# Altium schematic sheet 1_MCU.schdoc
size 429 x 307 mm; Symbol: Sheet-Symbol_A4; Device: Sheet-Symbol_A4; @Project Name: Stratus-Hackpad; @Page Count: 2; @Update Date: 2026-03-22; @Create Date: 2026-03-22; @Schematic Name: Stratus Hackpad; @Page No: 1; @Page Name: MCU; Company: Dhruvin Sarkar; Reviewed: EasyEDA; Version: V1.0; Page Size: A3; Part Number: JLCPCB-002; Drawn: Dhruvin Sarkar; @Board Name: Stratus Hackpad; @Create Time: 22:37:34; @Update Time: 22:43:27; Width: 1655; Height: 1170; Region Start: 1; X Region Count: 6; Y Region Count: 4; Blade Width: 10; Title Block Position: 3
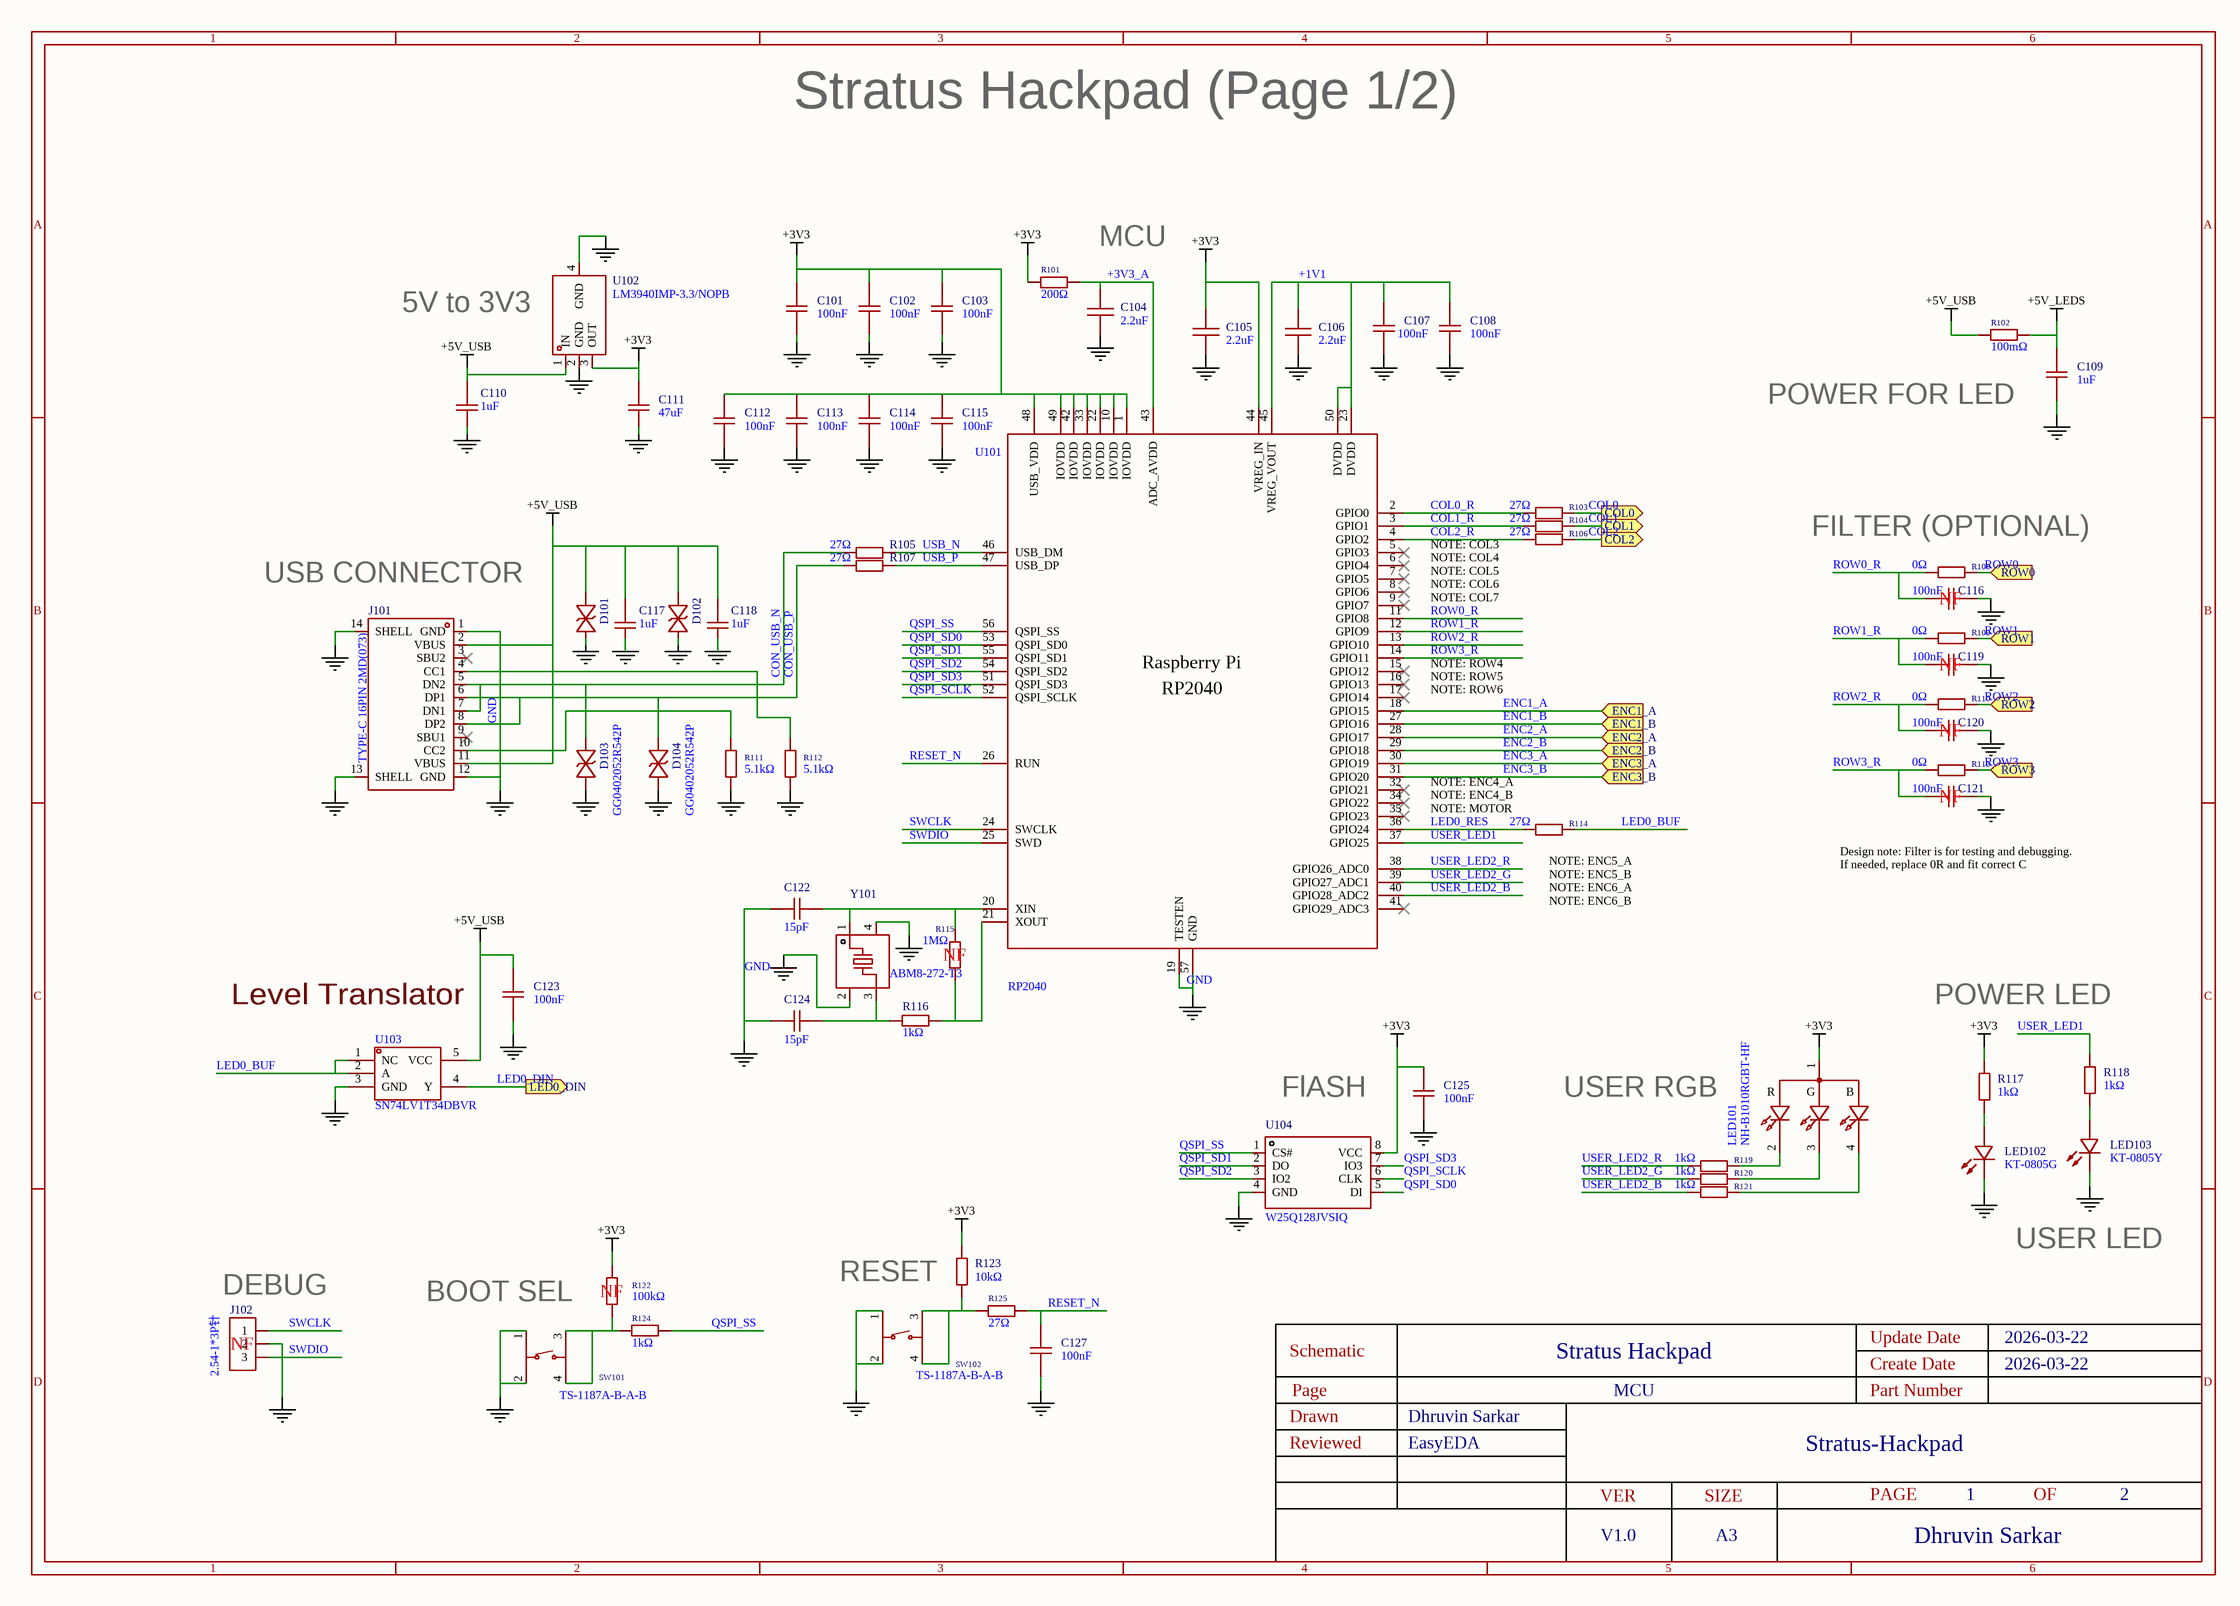
[diagram p0: 1_MCU.schdoc]

## Parts
C101  100nF  [C0402]
C102  100nF  [C0402]
C103  100nF  [C0402]
C104  2.2uF  [C0402]
C105  2.2uF  [C0402]
C106  2.2uF  [C0402]
C107  100nF  [C0402]
C108  100nF  [C0402]
C109  1uF  [C0402]
C110  1uF  [C0402]
C111  47uF  [C1206]
C112  100nF  [C0402]
C113  100nF  [C0402]
C114  100nF  [C0402]
C115  100nF  [C0402]
C116  100nF  [C0402]
C117  1uF  [C0402]
C118  1uF  [C0402]
C119  100nF  [C0402]
C120  100nF  [C0402]
C121  100nF  [C0402]
C122  15pF  [C0402]
C123  100nF  [C0402]
C124  15pF  [C0402]
C125  100nF  [C0402]
C127  100nF  [C0402]
D101  GG0402052R542P  [D0402-BI]  (value not drawn)
D102  GG0402052R542P  [D0402-BI]  (value not drawn)
D103  GG0402052R542P  [D0402-BI]
D104  GG0402052R542P  [D0402-BI]
J101  TYPE-C 16PIN 2MD(073)  [USB-C-SMD_TYPE-C-6PIN-2MD-073]
J102  2.54-1*3P针  [HDR-TH_3P-P2.54-V-M-1]
LED101  NH-B1010RGBT-HF  [LED-ARRAY-SMD_4P-L1.0-W1.0-TR_NH-B1010RGBT_1]
LED102  KT-0805G  [LED0805-R-RD]
LED103  KT-0805Y  [LED0805-R-RD]
R101  200Ω  [R0402]
R102  100mΩ  [R1206]
R103  27Ω  [R0402]
R104  27Ω  [R0402]
R105  27Ω  [R0402]
R106  27Ω  [R0402]
R107  27Ω  [R0402]
R108  0Ω  [R0402]
R109  0Ω  [R0402]
R110  0Ω  [R0402]
R111  5.1kΩ  [R0402]
R112  5.1kΩ  [R0402]
R113  0Ω  [R0402]
R114  27Ω  [R0402]
R115  1MΩ  [R0402]
R116  1kΩ  [R0402]
R117  1kΩ  [R0402]
R118  1kΩ  [R0402]
R119  1kΩ  [R0402]
R120  1kΩ  [R0402]
R121  1kΩ  [R0402]
R122  100kΩ  [R0402]
R123  10kΩ  [R0402]
R124  1kΩ  [R0402]
R125  27Ω  [R0402]
SW101  TS-1187A-B-A-B  [SW-SMD_4P-L5.1-W5.1-P3.70-LS6.5-TL-2]
SW102  TS-1187A-B-A-B  [SW-SMD_4P-L5.1-W5.1-P3.70-LS6.5-TL-2]
U101  RP2040  [LQFN-56_L7.0-W7.0-P0.4-EP_1]
U102  LM3940IMP-3.3/NOPB  [SOT-223_L6.5-W3.5-P2.30-LS7.0-BR]
U103  SN74LV1T34DBVR  [SOT-23-5_L2.9-W1.6-P0.95-LS2.8-BR]
U104  W25Q128JVSIQ  [SOIC-8_L5.3-W5.3-P1.27-LS8.0-BL]
Y101  ABM8-272-T3  [CRYSTAL-SMD_4P-L3.2-W2.5-BL]

## Ports
COL0 (out), COL1 (out), COL2 (out), ENC1_A (in), ENC1_B (in), ENC2_A (in), ENC2_B (in), ENC3_A (in), ENC3_B (in), LED0_DIN (out), ROW0 (in), ROW1 (in), ROW2 (in), ROW3 (in)

## Nets
+3V3: C101.2 C102.2 C103.2 C105.2 C111.2 C112.2 C113.2 C114.2 C115.2 C125.2 LED101.1(+) R101.1 R117.2 R122.2 R123.2 U101.1(IOVDD) U101.10(IOVDD) U101.22(IOVDD) U101.33(IOVDD) U101.42(IOVDD) U101.44(VREG_IN) U101.48(USB_VDD) U101.49(IOVDD) U102.3(OUT) U104.8(VCC)
+5V_LEDS: C109.2 R102.2
+5V_USB: C110.2 C117.2 C118.2 C123.2 D101.2 D102.2 J101.2(VBUS) J101.11(VBUS) R102.1 U102.1(IN) U103.5(VCC)
CON_USB_P: C101.1 C102.1 C103.1 C104.1 C105.1 C106.1 C107.1 C108.1 C109.1 C110.1 C111.1 C112.1 C113.1 C114.1 C115.1 C116.1 C117.1 C118.1 C119.1 C120.1 C121.1 C122.2 C123.1 C124.2 C125.1 C127.1 D101.1 D102.1 D103.1 D104.1 D104.2 J101.1(GND) J101.6(DP1) J101.8(DP2) J101.12(GND) J101.13(SHELL) J101.14(SHELL) J102.2 LED102.2(K) LED103.2(-) R107.1 R111.1 R112.1 SW101.1(A) SW101.2(B) SW102.1(A) SW102.2(B) U101.19(TESTEN) U101.57(GND) U102.2(GND) U102.4(GND) U103.3(GND) U104.4(GND) Y101.2(GND) Y101.4(GND)  [also labelled GND]
+1V1: C106.2 C107.2 C108.2 U101.23(DVDD) U101.45(VREG_VOUT) U101.50(DVDD)
+3V3_A: C104.2 R101.2 U101.43(ADC_AVDD)
COL0: R103.2 ; port COL0
COL0_R: R103.1 U101.2(GPIO0)
COL1: R104.2 ; port COL1
COL1_R: R104.1 U101.3(GPIO1)
COL2: R106.2 ; port COL2
COL2_R: R106.1 U101.4(GPIO2)
CON_USB_N: D103.2 J101.5(DN2) J101.7(DN1) R105.1
ENC1_A: U101.18(GPIO15) ; port ENC1_A
ENC1_B: U101.27(GPIO16) ; port ENC1_B
ENC2_A: U101.28(GPIO17) ; port ENC2_A
ENC2_B: U101.29(GPIO18) ; port ENC2_B
ENC3_A: U101.30(GPIO19) ; port ENC3_A
ENC3_B: U101.31(GPIO20) ; port ENC3_B
LED0_BUF: R114.2 U103.1(NC) U103.2(A)
LED0_DIN: U103.4(Y) ; port LED0_DIN
LED0_RES: R114.1 U101.36(GPIO24)
QSPI_SCLK: U101.52(QSPI_SCLK) U104.6(CLK)
QSPI_SD0: U101.53(QSPI_SD0) U104.5(DI)
QSPI_SD1: U101.55(QSPI_SD1) U104.2(DO)
QSPI_SD2: U101.54(QSPI_SD2) U104.3(IO2)
QSPI_SD3: U101.51(QSPI_SD3) U104.7(IO3)
QSPI_SS: R124.2 U101.56(QSPI_SS) U104.1(CS#)
RESET_N: C127.2 R125.2 U101.26(RUN)
ROW0: R108.2 ; port ROW0
ROW0_R: C116.2 R108.1 U101.11(GPIO8)
ROW1: R109.2 ; port ROW1
ROW1_R: C119.2 R109.1 U101.12(GPIO9)
ROW2: R110.2 ; port ROW2
ROW2_R: C120.2 R110.1 U101.13(GPIO10)
ROW3: R113.2 ; port ROW3
ROW3_R: C121.2 R113.1 U101.14(GPIO11)
SWCLK: J102.1 U101.24(SWCLK)
SWDIO: J102.3 U101.25(SWD)
USB_N: R105.2 U101.46(USB_DM)
USB_P: R107.2 U101.47(USB_DP)
USER_LED1: R118.2 U101.37(GPIO25)
USER_LED2_B: R121.2 U101.40(GPIO28_ADC2)
USER_LED2_G: R120.2 U101.39(GPIO27_ADC1)
USER_LED2_R: R119.2 U101.38(GPIO26_ADC0)
NetC122_1: C122.1 R115.2 U101.20(XIN) Y101.1
NetC124_1: C124.1 R116.1 Y101.3
NetJ101_4: J101.4(CC1) R112.2
NetJ101_10: J101.10(CC2) R111.2
NetLED101_2: LED101.2(-) R119.1
NetLED101_3: LED101.3(-) R120.1
NetLED101_4: LED101.4(-) R121.1
NetLED102_1: LED102.1(A) R117.1
NetLED103_1: LED103.1(+) R118.1
NetR115_1: R115.1 R116.2 U101.21(XOUT)
NetR122_1: R122.1 R124.1 SW101.3(C) SW101.4(D)
NetR123_1: R123.1 R125.1 SW102.3(C) SW102.4(D)

Not connected (* = marked no-connect by the designer): J101 3(SBU2)* 9(SBU1)*; U101 5(GPIO3)* 6(GPIO4)* 7(GPIO5)* 8(GPIO6)* 9(GPIO7)* 15(GPIO12)* 16(GPIO13)* 17(GPIO14)* 32(GPIO21)* 34(GPIO22)* 35(GPIO23)* 41(GPIO29_ADC3)*

## Notes on the sheet
- Stratus Hackpad (Page 1/2)
- MCU
- (near U102) 5V to 3V3
- (near R102) POWER FOR LED
- (near J101) USB CONNECTOR
- NOTE: COL3
- NOTE: COL4
- NOTE: COL5
- (near R108) FILTER (OPTIONAL)
- NOTE: COL6
- NOTE: COL7
- (near C116) NF
- NOTE: ROW4
- NOTE: ROW5
- NOTE: ROW6
- (near C119) NF
- (near C120) NF
- NOTE: ENC4_A
- NOTE: ENC4_B
- NOTE: MOTOR
- Design note: Filter is for testing and debugging.
  If needed, replace 0R and fit correct C
- (near C121) NF
- (near R114) NOTE: ENC5_A
- (near R114) NOTE: ENC5_B
- NOTE: ENC6_A
- (near R115) NF
- NOTE: ENC6_B
- Level Translator
- POWER LED
- FlASH
- USER RGB
- USER LED
- (near J102) DEBUG
- BOOT SEL
- (near R122) NF
- RESET
- (near J102) NF
- 1
- 2
- 3
- 4
- 5
- 6
- A
- B
- C
- Schematic
- Stratus Hackpad
- Create Date
- Update Date
- 2026-03-22
- D
- Drawn
- Page
- Dhruvin Sarkar
- Part Number
- Reviewed
- EasyEDA
- VER
- SIZE
- PAGE
- Stratus-Hackpad
- OF
- V1.0
- A3
- (in symbol NH-B1010RGBT-HF_RF_v1.0) R; G; B
- (in symbol RP2040_C2040_DS_v1.0) Raspberry Pi

## Library data of the parts
C101-C103 C107 C108 C112-C115 C123 C125 = CL05B104KO5NNNC: Manufacturer: SAMSUNG(三星); Add into BOM: yes; Tolerance: ±10%; Temperature Coefficient: X7R; Voltage Rating: 16V; Symbol: CL05B104KO5NNNC; Device: CL05B104KO5NNNC; LCSC Part Name: 100nF ±10% 16V; Supplier Part: C1525; Manufacturer Part: CL05B104KO5NNNC; Supplier Footprint: 0402; JLCPCB Part Class: Basic Part; Datasheet: https://atta.szlcsc.com/upload/public/pdf/source/20160218/1457707763339.pdf; Supplier: LCSC; Convert to PCB: yes; Value: 100nF
C104-C106 = CL05A225MQ5NSNC: Manufacturer: SAMSUNG(三星); Add into BOM: yes; Tolerance: ±20%; Temperature Coefficient: X5R; Voltage Rating: 6.3V; Symbol: CL05A225MQ5NSNC; Device: CL05A225MQ5NSNC; LCSC Part Name: 2.2uF ±20% 6.3V; Supplier Part: C12530; Manufacturer Part: CL05A225MQ5NSNC; Supplier Footprint: 0402; JLCPCB Part Class: Basic Part; Datasheet: https://atta.szlcsc.com/upload/public/pdf/source/20160218/1457707763339.pdf; Supplier: LCSC; Convert to PCB: yes; Value: 2.2uF
C109 C110 C117 C118 = CL05A105KA5NQNC: Manufacturer: SAMSUNG(三星); Add into BOM: yes; Tolerance: ±10%; Temperature Coefficient: X5R; Voltage Rating: 25V; Symbol: CL05A105KA5NQNC; Device: CL05A105KA5NQNC; LCSC Part Name: 1uF ±10% 25V; Supplier Part: C52923; Manufacturer Part: CL05A105KA5NQNC; Supplier Footprint: 0402; JLCPCB Part Class: Basic Part; Datasheet: https://atta.szlcsc.com/upload/public/pdf/source/20160218/1457707763339.pdf; Supplier: LCSC; Convert to PCB: yes; Value: 1uF
C111 = CL31A476MPHNNNE: Manufacturer: SAMSUNG(三星); Add into BOM: yes; Tolerance: ±20%; Temperature Coefficient: X5R; Voltage Rating: 10V; Symbol: CL31A476MPHNNNE; Device: CL31A476MPHNNNE; LCSC Part Name: 47uF ±20% 10V; Supplier Part: C96123; Manufacturer Part: CL31A476MPHNNNE; Supplier Footprint: 1206; JLCPCB Part Class: Basic Part; Datasheet: https://atta.szlcsc.com/upload/public/pdf/source/20160218/1457707763339.pdf; Supplier: LCSC; Convert to PCB: yes; Value: 47uF
C116 C119-C121 = CL05B104KO5NNNC: Manufacturer: SAMSUNG(三星); Add into BOM: no; Convert to PCB: yes; Tolerance: ±10%; Temperature Coefficient: X7R; Voltage Rating: 16V; Symbol: CL05B104KO5NNNC; Device: CL05B104KO5NNNC; LCSC Part Name: 100nF ±10% 16V; Supplier Part: C1525; Manufacturer Part: CL05B104KO5NNNC; Supplier Footprint: 0402; JLCPCB Part Class: Basic Part; Datasheet: https://atta.szlcsc.com/upload/public/pdf/source/20160218/1457707763339.pdf; Supplier: LCSC; Value: 100nF
C122 C124 = CL05C150JB5NNNC: Manufacturer: SAMSUNG(三星); Add into BOM: yes; Tolerance: ±5%; Temperature Coefficient: C0G; Voltage Rating: 50V; Symbol: CL05C150JB5NNNC; Device: CL05C150JB5NNNC; LCSC Part Name: 15pF ±5% 50V; Supplier Part: C86285; Manufacturer Part: CL05C150JB5NNNC; Supplier Footprint: 0402; JLCPCB Part Class: Extended Part; Datasheet: https://atta.szlcsc.com/upload/public/pdf/source/20160218/1457707763339.pdf; Supplier: LCSC; Convert to PCB: yes; Value: 15pF
C127 = CL05B104KO5NNNC: Manufacturer: SAMSUNG(三星); Add into BOM: yes; Tolerance: ±10%; Symbol: CL05B104KO5NNNC; Device: CL05B104KO5NNNC; LCSC Part Name: 100nF ±10% 16V; Supplier Part: C1525; Manufacturer Part: CL05B104KO5NNNC; Supplier Footprint: 0402; JLCPCB Part Class: Basic Part; Datasheet: https://atta.szlcsc.com/upload/public/pdf/source/20160218/1457707763339.pdf; Supplier: LCSC; Convert to PCB: yes; Value: 100nF
D101-D104 = GG0402052R542P: Manufacturer: Kyocera AVX; Add into BOM: yes; Reverse Stand-Off Voltage (Vrwm): 5V; Maximum Clamping Voltage: 15.5V; Peak Pulse Current (Ipp)@10/1000us: 3A@8/20us; Peak Pulse Power Dissipation (Ppp)@10/1000us: 46W; Breakdown Voltage: 5.5V; Type: TVS; Peak Pulse Power Dissipation (Ppp): 46W@8/20us; Reverse Leakage Current (Ir): 100nA; level of protection: IEC 61000-4-4；IEC 61000-4-2; Junction Capacitance: 2.5pF; Symbol: GG0402052R542P; Device: GG0402052R542P; LCSC Part Name: TVS 5V截止 3A峰值脉冲; Supplier Part: C1973257; Manufacturer Part: GG0402052R542P; Supplier Footprint: 0402; JLCPCB Part Class: Extended Part; Datasheet: https://atta.szlcsc.com/upload/public/pdf/source/20230915/02C5CA4E262376923D9117899A14A9C6.pdf; Supplier: LCSC; Convert to PCB: yes; Clamping Voltage: 15.5V; Peak Pulse Current (Ipp): 3A@8/20us; Voltage - Breakdown: 5.5V; Operating Temperature: -55℃~+125℃
J101 = TYPE-C 16PIN 2MD(073): Manufacturer: SHOU HAN(首韩); Add into BOM: yes; Gender: Female; Number of Contacts: 16P; Number of Ports: 1; Current Rating - Power (Max): 5A; Rated Voltage (Max): 5V; Connect-Disconnect Life: 5000 Cuts; Core Colour: Black; Current Rating-Power: 3A; Symbol: TYPE-C 16PIN 2MD(073); Device: TYPE-C 16PIN 2MD(073); LCSC Part Name: Type-C 母 卧贴; Supplier Part: C2765186; Manufacturer Part: TYPE-C 16PIN 2MD(073); Supplier Footprint: SMD; JLCPCB Part Class: Extended Part; Datasheet: https://atta.szlcsc.com/upload/public/pdf/source/20211123/39B17C16241EAC15C5E277BDA434118E.pdf; Supplier: LCSC; Convert to PCB: yes; Connector Type: Type-C; Standard: USB 3.1; Mounting Style: Horizontal attachment; Operating Temperature Range: -25℃~+85℃; Protocol Standard: -; Mounting Type: Surface Mount, Right Angle; Voltage Rating: 5V; Supplementary Features: -; Center Height: -; Length: -; Detection color: Black; Operating Temperature: -25℃~+85℃
J102 = 2.54-1*3P针: Manufacturer: BOOMELE(博穆精密); Symbol: Header-Male-2.54_1x3; Add into BOM: no; Convert to PCB: yes; Pin Structure: 1x3P; Pitch: 2.54mm; Circluar Pins/Square Pins: Square Pins; Current Rating (Max): 3A; Device: 2.54-1*3P针; LCSC Part Name: 间距:2.54mm 1x3P 直插 方针; Supplier Part: C49257; Manufacturer Part: 2.54-1*3P针; Supplier Footprint: 插件,P=2.54mm; JLCPCB Part Class: Extended Part; Datasheet: https://atta.szlcsc.com/upload/public/pdf/source/20221018/3E9408392E35E6F57A28985E5F7BF5C9.pdf; Supplier: LCSC; Row Spacing: -; Mounting Type: Straight; Number of Rows: Plugin; Number of Pins: 3P; Voltage Rating (Max): -; Length of Mating Pin: -; Insulation Height: -; Length of End Connection Pin: -; Contact Material: Brass; Contact Plating: -; Operating Temperature Range: -40℃~+105℃; Color: Black; Current Rating: 3A; Operating Temperature: -40℃~+105℃
LED101 = NH-B1010RGBT-HF_RF_v1.0: Manufacturer: 国星光电; Add into BOM: yes; Diode Configuration: Common Anode; Dominant Wavelength: R:620nm；G:530nm；B:470nm; Luminous Intensity: R:18mcd；G:25mcd；B:4.5mcd; Viewing Angle: 120°; Forward Current: B:2mA；G:2mA；R:5mA; Forward Voltage: R:2V；G:2.6V；B:2.7V; Installation Method: Positive Stick; Symbol: NH-B1010RGBT-HF_RF_v1.0; Device: NH-B1010RGBT-HF_RF_v1.0; LCSC Part Name: NH-B1010RGBT-HF; Supplier Part: C2874113; Manufacturer Part: NH-B1010RGBT-HF; Supplier Footprint: SMD-4P,1x1mm; Datasheet: https://atta.szlcsc.com/upload/public/pdf/source/20210810/0B2E174735C36A18A5A2783CB3D0373F.pdf; Supplier: LCSC; Convert to PCB: yes; Operating Temperature: -30℃~+85℃
LED102 = KT-0805G: Manufacturer: KENTO; Symbol: 0805G (Green); Add into BOM: yes; Emitted Color: Emerald; Illumination Color: Emerald Green; Voltage - Forward(Vf): 2.6V~3.1V; Power(Watts): 100mW; Wavelength - Dominant: 513nm~528nm; Device: KT-0805G; LCSC Part Name: 0805 翠绿 高亮; Supplier Part: C2297; Manufacturer Part: KT-0805G; Supplier Footprint: 0805; JLCPCB Part Class: Basic Part; Datasheet: https://atta.szlcsc.com/upload/public/pdf/source/20170209/1486607340485.pdf; Supplier: LCSC; Convert to PCB: yes; Lamp Holder Type: -; Forward Voltage (VF): -; Power Dissipation: -; Forward Current: -; Dominant Wavelength: -; Peak Wavelength: -; Diode Configuration: -; Lens Color: -; Color Temperature: -; Luminous Intensity: -; Viewing Angle: -; Mounting Sytle: -; Operating Temperature: -; Mounting Style: -
LED103 = KT-0805Y: Manufacturer: KENTO; Symbol: 17-21SUYC/TR8; Add into BOM: yes; Emitted Color: Yellow; Voltage - Forward(Vf): 1.8V~2.4V; Power(Watts): 40mW; Wavelength - Dominant: 584nm~594nm; Luminous Intensity: 175mcd; Device: KT-0805Y; LCSC Part Name: 0805 黄灯 高亮; Supplier Part: C2296; Manufacturer Part: KT-0805Y; Supplier Footprint: 0805; JLCPCB Part Class: Basic Part; Datasheet: https://atta.szlcsc.com/upload/public/pdf/source/20160421/1461205044170.pdf; Supplier: LCSC; Convert to PCB: yes; Power Dissipation: -; Forward Current: -; Dominant Wavelength: -; Peak Wavelength: -; Diode Configuration: -; Lens Color: -; Color Temperature: -; Viewing Angle: -; Mounting Sytle: -; Operating Temperature: -; Lamp Holder Type: -; Illumination Color: Yellow; Mounting Style: -
R101 = 0402WGF2000TCE: Manufacturer: UNI-ROYAL(厚声); Add into BOM: yes; Tolerance: ±1%; Power(Watts): 62.5mW; Temperature Coefficient: ±100ppm/℃; Voltage-Supply(Max): 50V; Symbol: 0402WGF2000TCE; Device: 0402WGF2000TCE; Supplier: LCSC; Manufacturer Part: 0402WGF2000TCE; Supplier Part: C25087; Value: 200Ω; JLCPCB Part Class: Basic Part; LCSC Part Name: 200Ω ±1% 62.5mW 厚膜电阻; Supplier Footprint: 0402; Datasheet: https://atta.szlcsc.com/upload/public/pdf/source/20200306/C422600_1E6D84923E4A46A82E41ADD87F860B5C.pdf; Convert to PCB: yes; Type: Thick Film Resistors; Operating Temperature Range: -55℃~+155℃; Operating Temperature: -55℃~+155℃
R102 = 1206W4F100LT5E: Manufacturer: UNI-ROYAL(厚声); Add into BOM: yes; Tolerance: ±1%; Temperature Coefficient: ±800ppm/℃; Symbol: 1206W4F100LT5E; Device: 1206W4F100LT5E; Supplier: LCSC; Manufacturer Part: 1206W4F100LT5E; Supplier Part: C25334; Value: 100mΩ; JLCPCB Part Class: Basic Part; LCSC Part Name: 100mΩ ±1% 250mW 厚膜电阻; Supplier Footprint: 1206; Datasheet: https://atta.szlcsc.com/upload/public/pdf/source/20200306/C422600_1E6D84923E4A46A82E41ADD87F860B5C.pdf; Convert to PCB: yes; Type: Thick Film Resistors; Operating Temperature Range: -55℃~+155℃
R103-R107 R114 = 0402WGF270JTCE: Manufacturer: UNI-ROYAL(厚声); Add into BOM: yes; Tolerance: ±1%; Power(Watts): 62.5mW; Temperature Coefficient: ±100ppm/℃; Voltage-Supply(Max): 50V; Symbol: 0402WGF270JTCE; Device: 0402WGF270JTCE; Supplier: LCSC; Manufacturer Part: 0402WGF270JTCE; Supplier Part: C25100; Value: 27Ω; JLCPCB Part Class: Extended Part; LCSC Part Name: 27Ω ±1% 62.5mW 厚膜电阻; Supplier Footprint: 0402; Datasheet: https://atta.szlcsc.com/upload/public/pdf/source/20200306/C422600_1E6D84923E4A46A82E41ADD87F860B5C.pdf; Convert to PCB: yes; Type: Thick Film Resistors; Operating Temperature Range: -55℃~+155℃; Operating Temperature: -55℃~+155℃
R108-R110 R113 = 0402WGF0000TCE: Manufacturer: UNI-ROYAL(厚声); Add into BOM: yes; Tolerance: ±1%; Temperature Coefficient: ±800ppm/℃; Symbol: 0402WGF0000TCE; Device: 0402WGF0000TCE; Supplier: LCSC; Manufacturer Part: 0402WGF0000TCE; Supplier Part: C17168; Value: 0Ω; JLCPCB Part Class: Basic Part; LCSC Part Name: 0Ω ±1% 62.5mW 厚膜电阻; Supplier Footprint: 0402; Datasheet: https://atta.szlcsc.com/upload/public/pdf/source/20200306/C422600_1E6D84923E4A46A82E41ADD87F860B5C.pdf; Convert to PCB: yes; Type: Thick Film Resistors; Operating Temperature Range: -55℃~+155℃
R111 R112 = 0402WGF5101TCE: Manufacturer: UNI-ROYAL(厚声); Add into BOM: yes; Tolerance: ±1%; Power(Watts): 62.5mW; Temperature Coefficient: ±100ppm/℃; Voltage-Supply(Max): 50V; Symbol: 0402WGF5101TCE; Device: 0402WGF5101TCE; Supplier: LCSC; Manufacturer Part: 0402WGF5101TCE; Supplier Part: C25905; Value: 5.1kΩ; JLCPCB Part Class: Basic Part; LCSC Part Name: 5.1kΩ ±1% 62.5mW 厚膜电阻; Supplier Footprint: 0402; Datasheet: https://atta.szlcsc.com/upload/public/pdf/source/20200306/C422600_1E6D84923E4A46A82E41ADD87F860B5C.pdf; Convert to PCB: yes; Type: Thick Film Resistors; Operating Temperature Range: -55℃~+155℃; Operating Temperature: -55℃~+155℃
R115 = 0402WGF1004TCE: Manufacturer: UNI-ROYAL(厚声); Add into BOM: no; Convert to PCB: yes; Tolerance: ±1%; Power(Watts): 62.5mW; Temperature Coefficient: ±100ppm/℃; Voltage-Supply(Max): 50V; Symbol: 0402WGF1004TCE; Device: 0402WGF1004TCE; Supplier: LCSC; Manufacturer Part: 0402WGF1004TCE; Supplier Part: C26083; Value: 1MΩ; JLCPCB Part Class: Basic Part; LCSC Part Name: 1MΩ ±1% 62.5mW 厚膜电阻; Supplier Footprint: 0402; Datasheet: https://atta.szlcsc.com/upload/public/pdf/source/20200306/C422600_1E6D84923E4A46A82E41ADD87F860B5C.pdf; Type: Thick Film Resistors; Operating Temperature Range: -55℃~+155℃; Operating Temperature: -55℃~+155℃
R116-R121 = 0402WGF1001TCE: Manufacturer: UNI-ROYAL(厚声); Add into BOM: yes; Tolerance: ±1%; Power(Watts): 62.5mW; Temperature Coefficient: ±100ppm/℃; Voltage-Supply(Max): 50V; Symbol: 0402WGF1001TCE; Device: 0402WGF1001TCE; LCSC Part Name: 1kΩ ±1% 62.5mW 厚膜电阻; Supplier Part: C11702; Manufacturer Part: 0402WGF1001TCE; Supplier Footprint: 0402; JLCPCB Part Class: Basic Part; Datasheet: https://atta.szlcsc.com/upload/public/pdf/source/20200306/C422600_1E6D84923E4A46A82E41ADD87F860B5C.pdf; Supplier: LCSC; Convert to PCB: yes; Type: Thick Film Resistors; Value: 1kΩ; Operating Temperature Range: -55℃~+155℃; Operating Temperature: -55℃~+155℃
R122 = 0402WGF1003TCE: Manufacturer: UNI-ROYAL(厚声); Add into BOM: no; Convert to PCB: yes; Tolerance: ±1%; Temperature Coefficient: ±100ppm/℃; Symbol: 0402WGF1003TCE; Device: 0402WGF1003TCE; Supplier: LCSC; Manufacturer Part: 0402WGF1003TCE; Supplier Part: C25741; Value: 100kΩ; JLCPCB Part Class: Basic Part; LCSC Part Name: 100kΩ ±1% 62.5mW 厚膜电阻; Supplier Footprint: 0402; Datasheet: https://atta.szlcsc.com/upload/public/pdf/source/20200306/C422600_1E6D84923E4A46A82E41ADD87F860B5C.pdf; Type: Thick Film Resistors; Operating Temperature Range: -55℃~+155℃
R123 = 0402WGF1002TCE: Manufacturer: UNI-ROYAL(厚声); Add into BOM: yes; Tolerance: ±1%; Temperature Coefficient: ±100ppm/℃; Symbol: 0402WGF1002TCE; Device: 0402WGF1002TCE; LCSC Part Name: 10kΩ ±1% 62.5mW 厚膜电阻; Supplier Part: C25744; Manufacturer Part: 0402WGF1002TCE; Supplier Footprint: 0402; JLCPCB Part Class: Basic Part; Datasheet: https://atta.szlcsc.com/upload/public/pdf/source/20200306/C422600_1E6D84923E4A46A82E41ADD87F860B5C.pdf; Supplier: LCSC; Convert to PCB: yes; Type: Thick Film Resistors; Value: 10kΩ; Operating Temperature Range: -55℃~+155℃
R124 = 0402WGF1001TCE: Manufacturer: UNI-ROYAL(厚声); Add into BOM: yes; Tolerance: ±1%; Temperature Coefficient: ±100ppm/℃; Symbol: 0402WGF1001TCE; Device: 0402WGF1001TCE; Supplier: LCSC; Manufacturer Part: 0402WGF1001TCE; Supplier Part: C11702; Value: 1kΩ; JLCPCB Part Class: Basic Part; LCSC Part Name: 1kΩ ±1% 62.5mW 厚膜电阻; Supplier Footprint: 0402; Datasheet: https://atta.szlcsc.com/upload/public/pdf/source/20200306/C422600_1E6D84923E4A46A82E41ADD87F860B5C.pdf; Convert to PCB: yes; Type: Thick Film Resistors; Operating Temperature Range: -55℃~+155℃
R125 = 0402WGF270JTCE: Manufacturer: UNI-ROYAL(厚声); Add into BOM: yes; Tolerance: ±1%; Temperature Coefficient: ±100ppm/℃; Symbol: 0402WGF270JTCE; Device: 0402WGF270JTCE; Supplier: LCSC; Manufacturer Part: 0402WGF270JTCE; Supplier Part: C25100; Value: 27Ω; JLCPCB Part Class: Extended Part; LCSC Part Name: 27Ω ±1% 62.5mW 厚膜电阻; Supplier Footprint: 0402; Datasheet: https://atta.szlcsc.com/upload/public/pdf/source/20200306/C422600_1E6D84923E4A46A82E41ADD87F860B5C.pdf; Convert to PCB: yes; Type: Thick Film Resistors; Operating Temperature Range: -55℃~+155℃
SW101 SW102 = TS-1187A-B-A-B: Manufacturer: XKB Connectivity(中国星坤); Add into BOM: yes; Circuit: SPST; Actuator Style: Round Button; Operating Force: 160gf; Switch Length: 5.1mm; Switch Height: 1.5mm; Strike Gundam: 不带; Contact Current: 50mA; Voltage Rating (DC): 12V; Actuator/Cap Color: 金色; With Lamp: No; Mechanical Life: 10万次; Symbol: TS-1187A-B-A-B; Device: TS-1187A-B-A-B; Supplier: LCSC; Supplier Part: C318884; Manufacturer Part: TS-1187A-B-A-B; JLCPCB Part Class: Basic Part; LCSC Part Name: 5.1*5.1*1.5mm 立贴 轻触开关; Supplier Footprint: SMD; Datasheet: https://atta.szlcsc.com/upload/public/pdf/source/20200227/C318890_053E50208A88A7BA1965D8746000774E.pdf; Convert to PCB: yes; Mounting Style: Brick nogging; Switch Width: 5.1mm; Insulation Resistance: -; Operating Temperature: -30℃~+85℃
U101 = RP2040_C2040_DS_v1.0: Manufacturer: Raspberry Pi(树莓派); Symbol: RP2040_1; Add into BOM: yes; CPU Maximum Speed: 133MHz; Number of I/O: 30; ADC (Bit): 12bit; Device: RP2040_C2040_DS_v1.0; Convert to PCB: yes; Manufacturer Part: RP2040; Supplier: LCSC; Supplier Part: C2040; LCSC Part Name: RP2040（RP2B2）; Supplier Footprint: LQFN-56(7x7); JLCPCB Part Class: Extended Part; Datasheet: https://item.szlcsc.com/datasheet/RP2040/2392.html; CPU Core: -
U102 = LM3940IMP-3.3/NOPB: Manufacturer: TI(德州仪器); Add into BOM: yes; Output Type: Fixed; Maximum Input Voltage: 7.5V; Output Voltage: 3.3V; Output Current: 1A; Dropout Voltage: 200mV@(100mA); Output Polarity: Positive electrode; Number of Outputs: 1; Voltage - Supply: 5.5V; Voltage Dropout: 500mV@(1A); standby current: 10mA; Noise: 250uVrms; Output Configuration: Positive; Symbol: LM3940IMP-3.3/NOPB; Device: LM3940IMP-3.3/NOPB; LCSC Part Name: 用于 5V 至 3.3V 电压转换的 1A 低压降稳压器; Supplier Part: C140319; Manufacturer Part: LM3940IMP-3.3/NOPB; Supplier Footprint: SOT-223; JLCPCB Part Class: Extended Part; Datasheet: https://www.ti.com/cn/lit/gpn/lm3940; Supplier: LCSC; Convert to PCB: yes; Power Supply Rejection Ratio (PSRR): -; Feature: 防静电保护；Short-Circuit  Protection；低ESR；Thermal Protection(TSD)；Overcurrent Protection(OCP)；带使能; Operating Temperature: -40℃~+125℃; Features: Over Current Protection；Short Circuit Protection；Over Temperature Protection
U103 = SN74LV1T34DBVR_RF_v1.0: Manufacturer: TI(德州仪器); Add into BOM: yes; output type: 推挽; Supply Voltage: 1.6V~5.5V; Number of Elements: 1; Sink Current: 8mA; Logic Family: 74LV; Symbol: SN74LV1T34DBVR_RF_v1.0; Device: SN74LV1T34DBVR_RF_v1.0; LCSC Part Name: SN74LV1T34DBVR; Supplier Part: C100024; Manufacturer Part: SN74LV1T34DBVR; Supplier Footprint: SOT-23-5; Datasheet: https://www.ti.com/cn/lit/gpn/sn74lv1t34; Supplier: LCSC; Convert to PCB: yes; Input type: -; Number of Bits per Element: 1; Source Current: 8mA; Operating Temperature: -40℃~+125℃
U104 = W25Q128JVSIQ: Manufacturer: WINBOND(华邦); Symbol: W25Q128JVSIQTR; Add into BOM: yes; Memory Size: 128Mbit; Interface: SPI; Clock Frequency: 133MHz; Voltage - Supply: 2.7V~3.6V; Standby Supply Current: 1uA; Program / Erase Cycles: 100,000 Cycles; Block Erase Time(tBE): 120ms@(32KB); Device: W25Q128JVSIQ; LCSC Part Name: W25Q128JVSIQ 编带; Supplier Part: C97521; Manufacturer Part: W25Q128JVSIQ; Supplier Footprint: SOIC-8-208mil; JLCPCB Part Class: Basic Part; Datasheet: https://atta.szlcsc.com/upload/public/pdf/source/20170316/1489627409956.pdf; Supplier: LCSC; Convert to PCB: yes; Interface Type: -; Clock Frequency (fc): -; Supply Voltage: -; Page Programming Time (Tpp): -; Block Erase Time (tBE): -; Data Retention - TDR (Year): -; Operating Temperature: -
Y101 = ABM8-272-T3_C20625731: Manufacturer: ABRACON; Add into BOM: yes; Value: 12MHz; Normal temperature Frequency Tolerance: ±30ppm; Load Capacitance: 10pF; Equivalent Series Resistance(ESR): 50Ω; Symbol: ABM8-272-T3_C20625731; Device: ABM8-272-T3_C20625731; LCSC Part Name: ABM8-272-T3; Supplier Part: C20625731; Manufacturer Part: ABM8-272-T3; Supplier Footprint: SMD3225-4P; JLCPCB Part Class: Extended Part; Datasheet: https://atta.szlcsc.com/upload/public/pdf/source/20240227/A8BE43F636D80F75C9AF5C59EDF21E9A.pdf; Supplier: LCSC; Convert to PCB: yes; Type: Crystal Oscillator; Frequency Stability: ±30ppm; Operating Temperature: -40℃~+85℃